# Altium project HVAC_Eth.PrjPcb (part 2 of 2)

## Sheet CV060_IO.SchDoc
size A4
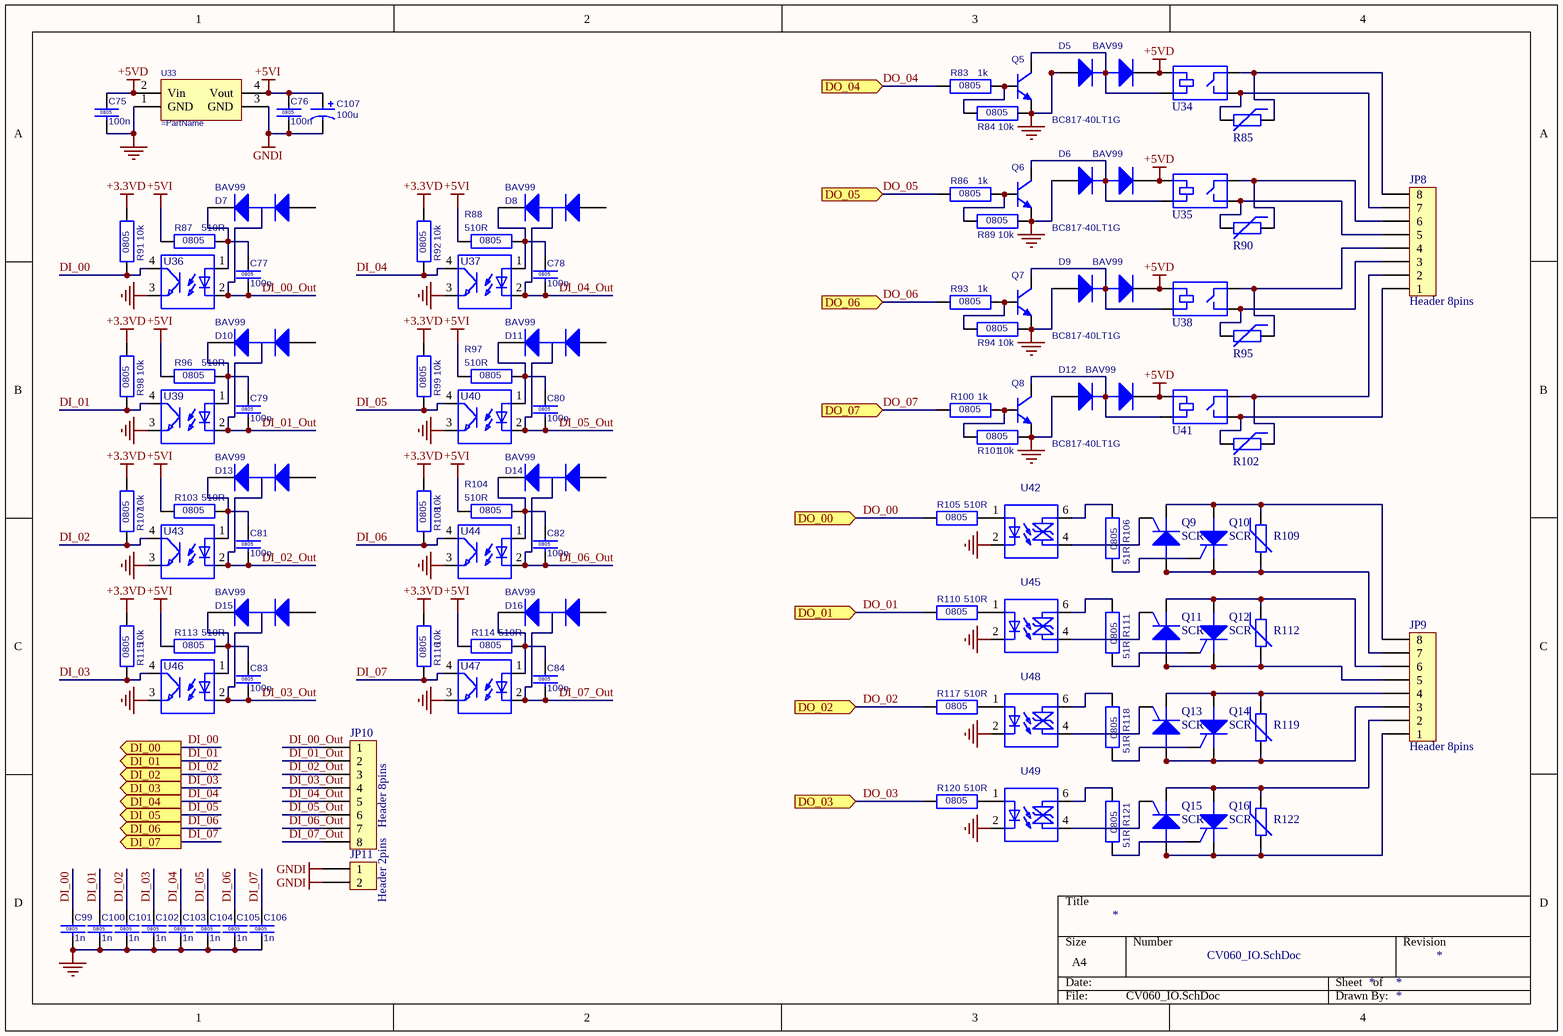
[diagram p2: CV060_IO.SchDoc]

### Parts
C75  Case: 0805  [RC0805]  (hidden comment: 100n)
C76  Case: 0805  [RC0805]  (hidden comment: 100n)
C77  Case: 0805  [RC0805]  (hidden comment: 100n)
C78  Case: 0805  [RC0805]  (hidden comment: 100n)
C79  Case: 0805  [RC0805]  (hidden comment: 100n)
C80  Case: 0805  [RC0805]  (hidden comment: 100n)
C81  Case: 0805  [RC0805]  (hidden comment: 100n)
C82  Case: 0805  [RC0805]  (hidden comment: 100n)
C83  Case: 0805  [RC0805]  (hidden comment: 100n)
C84  Case: 0805  [RC0805]  (hidden comment: 100n)
C99  Case: 0805  [RC0805]  (hidden comment: 1n)
C100  Case: 0805  [RC0805]  (hidden comment: 1n)
C101  Case: 0805  [RC0805]  (hidden comment: 1n)
C102  Case: 0805  [RC0805]  (hidden comment: 1n)
C103  Case: 0805  [RC0805]  (hidden comment: 1n)
C104  Case: 0805  [RC0805]  (hidden comment: 1n)
C105  Case: 0805  [RC0805]  (hidden comment: 1n)
C106  Case: 0805  [RC0805]  (hidden comment: 1n)
C107  100u  [CEH12.5D5P2.5]
D5  BAV99  [SOT23-3]
D6  BAV99  [SOT23-3]
D7  BAV99  [SOT23-3]
D8  BAV99  [SOT23-3]
D9  BAV99  [SOT23-3]
D10  BAV99  [SOT23-3]
D11  BAV99  [SOT23-3]
D12  BAV99  [SOT23-3]
D13  BAV99  [SOT23-3]
D14  BAV99  [SOT23-3]
D15  BAV99  [SOT23-3]
D16  BAV99  [SOT23-3]
JP8  Header 8pins  [PHOENIX_5.08_8PINS]
JP9  Header 8pins  [PHOENIX_5.08_8PINS]
JP10  Header 8pins  [PHOENIX_5.08_8PINS]
JP11  Header 2pins  [PHOENIX_5.08_2PINS]
Q5  Part number: BC817-40LT1G  [SOT23-3]  (hidden comment: NPN_transistor_SOT23-3)
Q6  Part number: BC817-40LT1G  [SOT23-3]  (hidden comment: NPN_transistor_SOT23-3)
Q7  Part number: BC817-40LT1G  [SOT23-3]  (hidden comment: NPN_transistor_SOT23-3)
Q8  Part number: BC817-40LT1G  [SOT23-3]  (hidden comment: NPN_transistor_SOT23-3)
Q9  SCR  [TO-220AB_V]
Q10  SCR  [TO-220AB_V]
Q11  SCR  [TO-220AB_V]
Q12  SCR  [TO-220AB_V]
Q13  SCR  [TO-220AB_V]
Q14  SCR  [TO-220AB_V]
Q15  SCR  [TO-220AB_V]
Q16  SCR  [TO-220AB_V]
R83  Case: 0805  [RC0805]  (hidden comment: 1k)
R84  Case: 0805  [RC0805]  (hidden comment: 10k)
R85  Varistor  [ROV07]  (value not drawn)
R86  Case: 0805  [RC0805]  (hidden comment: 1k)
R87  Case: 0805  [RC0805]  (hidden comment: 510R)
R88  Case: 0805  [RC0805]  (hidden comment: 510R)
R89  Case: 0805  [RC0805]  (hidden comment: 10k)
R90  Varistor  [ROV07]  (value not drawn)
R91  Case: 0805  [RC0805]  (hidden comment: 10k)
R92  Case: 0805  [RC0805]  (hidden comment: 10k)
R93  Case: 0805  [RC0805]  (hidden comment: 1k)
R94  Case: 0805  [RC0805]  (hidden comment: 10k)
R95  Varistor  [ROV07]  (value not drawn)
R96  Case: 0805  [RC0805]  (hidden comment: 510R)
R97  Case: 0805  [RC0805]  (hidden comment: 510R)
R98  Case: 0805  [RC0805]  (hidden comment: 10k)
R99  Case: 0805  [RC0805]  (hidden comment: 10k)
R100  Case: 0805  [RC0805]  (hidden comment: 1k)
R101  Case: 0805  [RC0805]  (hidden comment: 10k)
R102  Varistor  [ROV07]  (value not drawn)
R103  Case: 0805  [RC0805]  (hidden comment: 510R)
R104  Case: 0805  [RC0805]  (hidden comment: 510R)
R105  Case: 0805  [RC0805]  (hidden comment: 510R)
R106  Case: 0805  [RC0805]  (hidden comment: 51R)
R107  Case: 0805  [RC0805]  (hidden comment: 10k)
R108  Case: 0805  [RC0805]  (hidden comment: 10k)
R109  Varistor  [ROV07]  (value not drawn)
R110  Case: 0805  [RC0805]  (hidden comment: 510R)
R111  Case: 0805  [RC0805]  (hidden comment: 51R)
R112  Varistor  [ROV07]  (value not drawn)
R113  Case: 0805  [RC0805]  (hidden comment: 510R)
R114  Case: 0805  [RC0805]  (hidden comment: 510R)
R115  Case: 0805  [RC0805]  (hidden comment: 10k)
R116  Case: 0805  [RC0805]  (hidden comment: 10k)
R117  Case: 0805  [RC0805]  (hidden comment: 510R)
R118  Case: 0805  [RC0805]  (hidden comment: 51R)
R119  Varistor  [ROV07]  (value not drawn)
R120  Case: 0805  [RC0805]  (hidden comment: 510R)
R121  Case: 0805  [RC0805]  (hidden comment: 51R)
R122  Varistor  [ROV07]  (value not drawn)
U33  (no value)  [SIP4]
U34  NPA-AS5-DC5V  [NPA-AS5-DC5V]  (value not drawn)
U35  NPA-AS5-DC5V  [NPA-AS5-DC5V]  (value not drawn)
U36  PC817  [DIP4]  (value not drawn)
U37  PC817  [DIP4]  (value not drawn)
U38  NPA-AS5-DC5V  [NPA-AS5-DC5V]  (value not drawn)
U39  PC817  [DIP4]  (value not drawn)
U40  PC817  [DIP4]  (value not drawn)
U41  NPA-AS5-DC5V  [NPA-AS5-DC5V]  (value not drawn)
U42  MOC3063  [DIP6]  (value not drawn)
U43  PC817  [DIP4]  (value not drawn)
U44  PC817  [DIP4]  (value not drawn)
U45  MOC3063  [DIP6]  (value not drawn)
U46  PC817  [DIP4]  (value not drawn)
U47  PC817  [DIP4]  (value not drawn)
U48  MOC3063  [DIP6]  (value not drawn)
U49  MOC3063  [DIP6]  (value not drawn)

### Ports
DI_00 (out), DI_01 (out), DI_02 (out), DI_03 (out), DI_04 (out), DI_05 (out), DI_06 (out), DI_07 (out), DO_00 (in), DO_01 (in), DO_02 (in), DO_03 (in), DO_04 (in), DO_05 (in), DO_06 (in), DO_07 (in)

### Nets
+3.3VD: R91.2 R92.2 R98.2 R99.2 R107.2 R108.2 R115.2 R116.2
+5VD: C75.1 D5.2(K) D6.2(K) D9.2(K) D12.2(K) U33.2(Vin) U34.1 U35.1 U38.1 U41.1
+5VI: C76.1 C107.1 R87.1 R88.1 R96.1 R97.1 R103.1 R104.1 R113.1 R114.1 U33.4(Vout)
DGND: C75.2 C99.2 C100.2 C101.2 C102.2 C103.2 C104.2 C105.2 C106.2 D5.1(A) D6.1(A) D9.1(A) D12.1(A) Q5.2(E) Q6.2(E) Q7.2(E) Q8.2(E) R84.2 R89.2 R94.2 R101.2 U33.1(GND) U36.3 U37.3 U39.3 U40.3 U42.2 U43.3 U44.3 U45.2 U46.3 U47.3 U48.2 U49.2
GNDI: C76.2 C107.2 JP11.1 JP11.2 U33.3(GND)
DI_00: C99.1 R91.1 U36.4 ; port DI_00
DI_00_Out: C77.2 D7.3(C) JP10.1 U36.2
DI_01: C100.1 R98.1 U39.4 ; port DI_01
DI_01_Out: C79.2 D10.3(C) JP10.2 U39.2
DI_02: C101.1 R107.1 U43.4 ; port DI_02
DI_02_Out: C81.2 D13.3(C) JP10.3 U43.2
DI_03: C102.1 R115.1 U46.4 ; port DI_03
DI_03_Out: C83.2 D15.3(C) JP10.4 U46.2
DI_04: C103.1 R92.1 U37.4 ; port DI_04
DI_04_Out: C78.2 D8.3(C) JP10.5 U37.2
DI_05: C104.1 R99.1 U40.4 ; port DI_05
DI_05_Out: C80.2 D11.3(C) JP10.6 U40.2
DI_06: C105.1 R108.1 U44.4 ; port DI_06
DI_06_Out: C82.2 D14.3(C) JP10.7 U44.2
DI_07: C106.1 R116.1 U47.4 ; port DI_07
DI_07_Out: C84.2 D16.3(C) JP10.8 U47.2
DO_00: R105.1 ; port DO_00
DO_01: R110.1 ; port DO_01
DO_02: R117.1 ; port DO_02
DO_03: R120.1 ; port DO_03
DO_04: R83.1 ; port DO_04
DO_05: R86.1 ; port DO_05
DO_06: R93.1 ; port DO_06
DO_07: R100.1 ; port DO_07
NetC77_1: C77.1 D7.2(K) R87.2 U36.1
NetC78_1: C78.1 D8.2(K) R88.2 U37.1
NetC79_1: C79.1 D10.2(K) R96.2 U39.1
NetC80_1: C80.1 D11.2(K) R97.2 U40.1
NetC81_1: C81.1 D13.2(K) R103.2 U43.1
NetC82_1: C82.1 D14.2(K) R104.2 U44.1
NetC83_1: C83.1 D15.2(K) R113.2 U46.1
NetC84_1: C84.1 D16.2(K) R114.2 U47.1
NetD5_3: D5.3(C) Q5.3(C) U34.2
NetD6_3: D6.3(C) Q6.3(C) U35.2
NetD9_3: D9.3(C) Q7.3(C) U38.2
NetD12_3: D12.3(C) Q8.3(C) U41.2
NetJP8_1: JP8.1 R102.2 U41.4
NetJP8_2: JP8.2 R102.1 U41.3
NetJP8_3: JP8.3 R95.2 U38.4
NetJP8_4: JP8.4 R95.1 U38.3
NetJP8_5: JP8.5 R90.2 U35.4
NetJP8_6: JP8.6 R90.1 U35.3
NetJP8_7: JP8.7 R85.2 U34.4
NetJP8_8: JP8.8 R85.1 U34.3
NetJP9_1: JP9.1 Q15.2(A) Q15.4(TAB) Q16.1(K) R122.2
NetJP9_2: JP9.2 Q15.1(K) Q16.2(A) Q16.4(TAB) R122.1
NetJP9_3: JP9.3 Q13.2(A) Q13.4(TAB) Q14.1(K) R119.2
NetJP9_4: JP9.4 Q13.1(K) Q14.2(A) Q14.4(TAB) R119.1
NetJP9_5: JP9.5 Q11.2(A) Q11.4(TAB) Q12.1(K) R112.2
NetJP9_6: JP9.6 Q11.1(K) Q12.2(A) Q12.4(TAB) R112.1
NetJP9_7: JP9.7 Q9.2(A) Q9.4(TAB) Q10.1(K) R109.2
NetJP9_8: JP9.8 Q9.1(K) Q10.2(A) Q10.4(TAB) R109.1
NetQ5_1: Q5.1(B) R83.2 R84.1
NetQ6_1: Q6.1(B) R86.2 R89.1
NetQ7_1: Q7.1(B) R93.2 R94.1
NetQ8_1: Q8.1(B) R100.2 R101.1
NetQ9_3: Q9.3(G) U42.4
NetQ10_3: Q10.3(G) R106.2
NetQ11_3: Q11.3(G) U45.4
NetQ12_3: Q12.3(G) R111.2
NetQ13_3: Q13.3(G) U48.4
NetQ14_3: Q14.3(G) R118.2
NetQ15_3: Q15.3(G) U49.4
NetQ16_3: Q16.3(G) R121.2
NetR105_2: R105.2 U42.1
NetR106_1: R106.1 U42.6
NetR110_2: R110.2 U45.1
NetR111_1: R111.1 U45.6
NetR117_2: R117.2 U48.1
NetR118_1: R118.1 U48.6
NetR120_2: R120.2 U49.1
NetR121_1: R121.1 U49.6

Not connected (* = marked no-connect by the designer): D7 1(A); D8 1(A); D10 1(A); D11 1(A); D13 1(A); D14 1(A); D15 1(A); D16 1(A)

### Library data of the parts
C75-C84 = CC0805K-X5R-50V0-100N: Chip capacitor, 20p; Manufacturer: KEMET, YAGEO; Voltage: 50V; Tolerance: 10%; ROSH: Yes; Material: X5R; Package: 7" paper reel; Part number: CC0805K-X5R-50V0-100N; Suppliers: Avnet; Temperature: -55 - +125 C; Value: 100n; Supplier: Avnet-Abacus; Pb Free: Yes; Component Type: Standard; ComponentLink1Description: Manufacturer Link; ComponentLink2Description: Datasheet; ComponentLink2URL: http://www.yageo.com/pdf/UPY-GPHC_X5R_6.3V-to-50V_3.pdf; Published: 05.04.2010; Publisher: ppavlov
C99-C106 = CC0805K-X5R-50V0-1N00: Chip capacitor, 20p; Manufacturer: KEMET, YAGEO; Voltage: 50V; Tolerance: 10%; ROSH: Yes; Material: X5R; Package: 7" paper reel; Part number: CC0805K-X5R-50V0-1N00; Suppliers: Avnet; Temperature: -55 - +125 C; Value: 1n; Supplier: Avnet-Abacus; Pb Free: Yes; Component Type: Standard; ComponentLink1Description: Manufacturer Link; ComponentLink2Description: Datasheet; ComponentLink2URL: http://www.yageo.com/pdf/UPY-GPHC_X5R_6.3V-to-50V_3.pdf; Published: 05.04.2010; Publisher: ppavlov
C107 = CEH12.5D5P2.5M-16V-100U: Electrolytic capacitor; Manufacturer: Panasonic; Manufacturer Part Number: C H12.5D5P2.5M-16V-100U; Voltage: 16V; Tolerance: 20%; Pb Free: Yes; Case: 12.5x5x2.5; Value: 100u; Part Number: CEH12.5D5P2.5M-16V-100U; Temperature: -55 - +105 C; Supplier: Megasan; MOQ: 500; Component Type: Standard; ComponentLink1Description: Manufacturer Link; ComponentLink2Description: Datasheet; ComponentLink2URL: http://industrial.panasonic.com/www-data/pdf/ABA0000/ABA0000CE22.pdf; Published: 11.12.2009; Publisher: ppavlov
D5-D16 = BAV99: Dual small signal diode; Manufacturer: Fairchild; Forward current: 0.2A; Breakdown Voltage: 70V; Pb Free: Yes; Stock ID: D040; Temperature: -55 - +150 C; Supplier: EBV; Manufacturer Part Number: BAV99; Component Type: Standard; ComponentLink1Description: Manufacturer Link; Case: SOT23-3; ComponentLink2Description: Datasheet; ComponentLink2URL: http://www.fairchildsemi.com/ds/BA%2FBAV99.pdf; Published: 16.11.2009; Publisher: tkondratyuk; Part Number: BAV99; Current: 0.2A; Voltage: 70V
JP8-JP10 = 2EDGR-5.08-08P-14: 5.08mm angled 8pins receptabe; Manufacturer Part Number: 2EDGR-5.0-08P-14; Pins number: 8; Pb Free: Yes; Part Number: 2EDGR-5.08-08P-14; Temperature: -40 - +105 C; Supplier: Biakom; Component Type: Standard; ComponentLink1Description: Manufacturer Link; Case: PHOENIX_5.08_8PINS; ComponentLink2Description: Datasheet; Published: 17.08.2010; Publisher: ppavlov
JP11 = 2EDGR-5.08-02P-14: 5mm angled 2pins receptabe; Manufacturer Part Number: 2EDGR-5.0-02P-14; Pins number: 2; Pb Free: Yes; Part Number: 2EDGR-5.08-02P-14; Temperature: -40 - +105 C; Component Type: Standard; ComponentLink1Description: Manufacturer Link; Case: PHOENIX_5.08_2PINS; ComponentLink2Description: Datasheet; Published: 04.01.2010; Publisher: ppavlov
Q5-Q8 = BC817-40LT1G: General Purpose  NPN Transistor; Manufacturer: ONS, NXP; Manufacturer Part Number: BC817?40LT1G; Current: 0.5A; Voltage CEO: 40V; Pb Free: Yes; Temperature: -55 - +150 C; Supplier: EBV; MOQ: 3000; Package: Tape and Reel; Component Type: Standard; ComponentLink1Description: Manufacturer Link; Case: SOT23-3; ComponentLink2Description: Datasheet; ComponentLink2URL: http://www.onsemi.com/pub/Collateral/BC817-16LT1-D.PDF; Published: 16.02.2010; Publisher: ppavlov
Q9-Q16 = BT151-800_V: Thyristor; Current: 8A; Voltage CEO: 800; Pb Free: Yes; Part Number: BT151-800_V; Temperature: -55 - +150 C; Manufacturer Part Number: BT151-800; Component Type: Standard; ComponentLink1Description: Manufacturer Link; Case: TO-220AB_H; ComponentLink2Description: Datasheet; Published: 08.04.2010; Publisher: ppavlov
R83 R86 R93 R100 = RC0805F-1K00: Chip resistor; Manufacturer: PHILIPS, SAMSUNG; Voltage: 200V; Power: 1/10W; Tolerance: 1%; Pb Free: Yes; Value: 1k; Part Number: RC0805F-1K00; Temperature: -55 - +155 C; Supplier: Megasan; Component Type: Standard; ComponentLink1Description: Manufacturer Link; ComponentLink2Description: Datasheet; ComponentLink2URL: http://www.yageo.com/pdf/PYu-RC1206_51_RoHS_L_4.pdf; Published: 11.12.2009; Publisher: ppavlov
R84 R89 R91 R92 R94 R98 R99 R101 R107 R108 R115 R116 = RC0805F-10K0: Chip resistor; Manufacturer: PHILIPS, SAMSUNG; Voltage: 200V; Power: 1/10W; Tolerance: 1%; Pb Free: Yes; Value: 10k; Part Number: RC0805F-10K0; Temperature: -55 - +155 C; Supplier: Megasan; Component Type: Standard; ComponentLink1Description: Manufacturer Link; ComponentLink2Description: Datasheet; ComponentLink2URL: http://www.yageo.com/pdf/PYu-RC1206_51_RoHS_L_4.pdf; Published: 11.12.2009; Publisher: ppavlov
R85 R90 R95 R102 R109 R112 R119 R122 = ROV07-391K: Manufacturer: Raychem; Manufacturer Part Number: ROV07-361K; Current: 10A; Voltage: 250AC; Pb Free: Yes; Part Number: ROV07-391K; Temperature: -40 - +125 C; Component Type: Standard; ComponentLink1Description: Manufacturer Link; Case: ROV07; ComponentLink2Description: Datasheet; Published: 17.08.2010; Publisher: ppavlov
R87 R88 R96 R97 R103-R105 R110 R113 R114 R117 R120 = RC0805F-510R: Chip resistor; Manufacturer: PHILIPS, SAMSUNG; Voltage: 200V; Power: 1/10W; Tolerance: 1%; Pb Free: Yes; Value: 510R; Part Number: RC0805F-510R; Temperature: -55 - +155 C; Supplier: Megasan; Component Type: Standard; ComponentLink1Description: Manufacturer Link; ComponentLink2Description: Datasheet; ComponentLink2URL: http://www.yageo.com/pdf/PYu-RC1206_51_RoHS_L_4.pdf; Published: 11.12.2009; Publisher: ppavlov
R106 R111 R118 R121 = RC0805F-51R0: Chip resistor; Manufacturer: PHILIPS, SAMSUNG; Voltage: 200V; Power: 1/10W; Tolerance: 1%; Pb Free: Yes; Value: 51R; Part Number: RC0805F-51R0; Temperature: -55 - +155 C; Supplier: Megasan; Component Type: Standard; ComponentLink1Description: Manufacturer Link; ComponentLink2Description: Datasheet; ComponentLink2URL: http://www.yageo.com/pdf/PYu-RC1206_51_RoHS_L_4.pdf; Published: 11.12.2009; Publisher: ppavlov
U33 = 1-05-05S: 1W Insulated DCDC converter; Manufacturer: TI; Manufacturer Part Number: E101E; Pb Free: Yes; Part Number: 1-05-05S; Temperature: -40 - +85 C; Component Type: Standard; ComponentLink1Description: Manufacturer Link; Case: SIP4; ComponentLink2Description: Datasheet; Published: 07.01.2010; Publisher: ppavlov
U34 U35 U38 U41 = NPA-AS5-DC5V: Standard; Part Number: NPA-AS5-DC5V; Manufacturer Part Number: NPA-AS5-DC5V; Package: NPA-AS5-DC5V; Component Type: Relay; Case: NPA-AS5-DC5V; Published: 05.04.2010; Publisher: ppavlov; ComponentLink2Description: Datasheet
U36 U37 U39 U40 U43 U44 U46 U47 = PC817C: General purpose optocouple; Manufacturer: Sharp; Part Number: PC817C; Manufacturer Part Number: PC817C; Component Type: Standard; ComponentLink1Description: Manufacturer Link; Case: DIP4; ComponentLink2Description: Datasheet; Published: 06.04.2010; Publisher: ppavlov
U42 U45 U48 U49 = MOC3063: Zero-Cross Phototriac Driver Optocoupler; Manufacturer: Fairchild; Part Number: MOC3063; Manufacturer Part Number: MOC3063; Component Type: Standard; ComponentLink1Description: Manufacturer Link; Case: DIP6; ComponentLink2Description: Datasheet; ComponentLink2URL: http://www.fairchildsemi.com/ds/MO%2FMOC3061-M.pdf; Published: 06.04.2010; Publisher: ppavlov

## Sheet CV060_AO.SchDoc
size A4
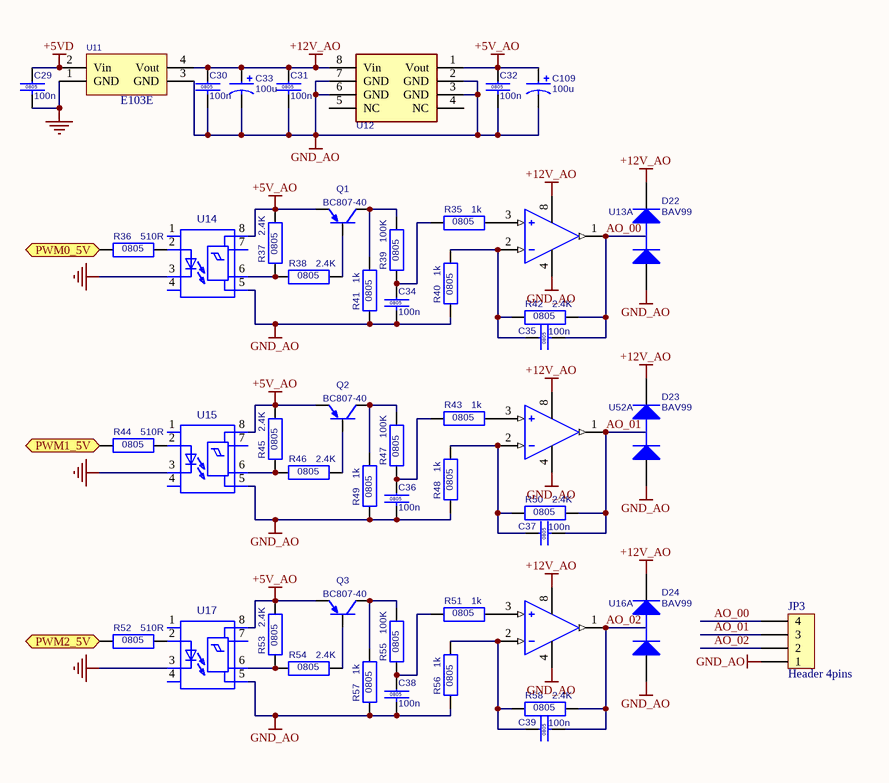
[diagram p3: CV060_AO.SchDoc]

### Parts
C29  Case: 0805  [RC0805]  (hidden comment: 100n)
C30  Case: 0805  [RC0805]  (hidden comment: 100n)
C31  Case: 0805  [RC0805]  (hidden comment: 100n)
C32  Case: 0805  [RC0805]  (hidden comment: 100n)
C33  100u  [CEH12.5D5P2.5]
C34  Case: 0805  [RC0805]  (hidden comment: 100n)
C35  Case: 0805  [RC0805]  (hidden comment: 100n)
C36  Case: 0805  [RC0805]  (hidden comment: 100n)
C37  Case: 0805  [RC0805]  (hidden comment: 100n)
C38  Case: 0805  [RC0805]  (hidden comment: 100n)
C39  Case: 0805  [RC0805]  (hidden comment: 100n)
C109  100u  [CEH12.5D5P2.5]
D22  BAV99  [SOT23-3]
D23  BAV99  [SOT23-3]
D24  BAV99  [SOT23-3]
JP3  Header 4pins  [PHOENIX_5.08_4PINS]
Q1  Part number: BC807-40  [SOT23-3]  (hidden comment: PNP_transistor_SOT23-3)
Q2  Part number: BC807-40  [SOT23-3]  (hidden comment: PNP_transistor_SOT23-3)
Q3  Part number: BC807-40  [SOT23-3]  (hidden comment: PNP_transistor_SOT23-3)
R35  Case: 0805  [RC0805]  (hidden comment: 1k)
R36  Case: 0805  [RC0805]  (hidden comment: 510R)
R37  Case: 0805  [RC0805]  (hidden comment: 2.4K)
R38  Case: 0805  [RC0805]  (hidden comment: 2.4K)
R39  Case: 0805  [RC0805]  (hidden comment: 100K)
R40  Case: 0805  [RC0805]  (hidden comment: 1k)
R41  Case: 0805  [RC0805]  (hidden comment: 1k)
R42  Case: 0805  [RC0805]  (hidden comment: 2.4K)
R43  Case: 0805  [RC0805]  (hidden comment: 1k)
R44  Case: 0805  [RC0805]  (hidden comment: 510R)
R45  Case: 0805  [RC0805]  (hidden comment: 2.4K)
R46  Case: 0805  [RC0805]  (hidden comment: 2.4K)
R47  Case: 0805  [RC0805]  (hidden comment: 100K)
R48  Case: 0805  [RC0805]  (hidden comment: 1k)
R49  Case: 0805  [RC0805]  (hidden comment: 1k)
R50  Case: 0805  [RC0805]  (hidden comment: 2.4K)
R51  Case: 0805  [RC0805]  (hidden comment: 1k)
R52  Case: 0805  [RC0805]  (hidden comment: 510R)
R53  Case: 0805  [RC0805]  (hidden comment: 2.4K)
R54  Case: 0805  [RC0805]  (hidden comment: 2.4K)
R55  Case: 0805  [RC0805]  (hidden comment: 100K)
R56  Case: 0805  [RC0805]  (hidden comment: 1k)
R57  Case: 0805  [RC0805]  (hidden comment: 1k)
R58  Case: 0805  [RC0805]  (hidden comment: 2.4K)
U11  Manufacturer Part Number: E103E  [SIP4]
U12  L78L05CD  [SO-8]  (value not drawn)
U13  LM2904D  [SO-8]  (value not drawn)  (part A of 2)
U14  6N137  [DIP8]  (value not drawn)
U15  6N137  [DIP8]  (value not drawn)
U16  LM2904D  [SO-8]  (value not drawn)  (part A of 2)
U17  6N137  [DIP8]  (value not drawn)
U52  LM2904D  [SO-8]  (value not drawn)  (part A of 2)

### Ports
PWM0_5V (in), PWM1_5V (in), PWM2_5V (in)

### Nets
+5V_AO: C32.1 C109.1 Q1.2(E) Q2.2(E) Q3.2(E) R37.2 R45.2 R53.2 U12.1(Vout) U14.8 U15.8 U17.8
+5VD: C29.1 U11.2(Vin)
+12V_AO: C30.1 C31.1 C33.1 D22.2(K) D23.2(K) D24.2(K) U11.4(Vout) U12.8(Vin) U13.8(Vcc+) U16.8(Vcc+) U52.8(Vcc+)
DGND: C29.2 U11.1(GND) U14.3 U15.3 U17.3
GND_AO: C30.2 C31.2 C32.2 C33.2 C34.2 C36.2 C38.2 C109.2 D22.1(A) D23.1(A) D24.1(A) JP3.1 R40.1 R41.1 R48.1 R49.1 R56.1 R57.1 U11.3(GND) U12.2(GND) U12.3(GND) U12.6(GND) U12.7(GND) U13.4(Vcc-) U14.5 U15.5 U16.4(Vcc-) U17.5 U52.4(Vcc-)
AO_00: C35.2 D22.3(C) JP3.4 R42.2 U13.1(OUT1)
AO_01: C37.2 D23.3(C) JP3.3 R50.2 U52.1(OUT1)
AO_02: C39.2 D24.3(C) JP3.2 R58.2 U16.1(OUT1)
NetC34_1: C34.1 R35.1 R39.1
NetC35_1: C35.1 R40.2 R42.1 U13.2(IN1-)
NetC36_1: C36.1 R43.1 R47.1
NetC37_1: C37.1 R48.2 R50.1 U52.2(IN1-)
NetC38_1: C38.1 R51.1 R55.1
NetC39_1: C39.1 R56.2 R58.1 U16.2(IN1-)
NetQ1_1: Q1.1(B) R38.2
NetQ1_3: Q1.3(C) R39.2 R41.2
NetQ2_1: Q2.1(B) R46.2
NetQ2_3: Q2.3(C) R47.2 R49.2
NetQ3_1: Q3.1(B) R54.2
NetQ3_3: Q3.3(C) R55.2 R57.2
NetR35_2: R35.2 U13.3(IN1+)
NetR36_1: R36.1 ; port PWM0_5V
NetR36_2: R36.2 U14.2
NetR37_1: R37.1 R38.1 U14.6
NetR43_2: R43.2 U52.3(IN1+)
NetR44_1: R44.1 ; port PWM1_5V
NetR44_2: R44.2 U15.2
NetR45_1: R45.1 R46.1 U15.6
NetR51_2: R51.2 U16.3(IN1+)
NetR52_1: R52.1 ; port PWM2_5V
NetR52_2: R52.2 U17.2
NetR53_1: R53.1 R54.1 U17.6

Not connected (* = marked no-connect by the designer): U12 4(NC) 5(NC); U14 1 4 7; U15 1 4 7; U17 1 4 7

### Library data of the parts
C29-C32 C34-C39 = CC0805K-X5R-50V0-100N: as C75 on sheet CV060_IO; Package: 7" paper reel; Part number: CC0805K-X5R-50V0-100N; Suppliers: Avnet; Temperature: -55 - +125 C; Value: 100n; Supplier: Avnet-Abacus; Pb Free: Yes; Component Type: Standard; ComponentLink1Description: Manufacturer Link; ComponentLink2Description: Datasheet; ComponentLink2URL: http://www.yageo.com/pdf/UPY-GPHC_X5R_6.3V-to-50V_3.pdf; Published: 05.04.2010; Publisher: ppavlov
C33 C109 = CEH12.5D5P2.5M-16V-100U: as C107 on sheet CV060_IO; Case: 12.5x5x2.5; Value: 100u; Part Number: CEH12.5D5P2.5M-16V-100U; Temperature: -55 - +105 C; Supplier: Megasan; MOQ: 500; Component Type: Standard; ComponentLink1Description: Manufacturer Link; ComponentLink2Description: Datasheet; ComponentLink2URL: http://industrial.panasonic.com/www-data/pdf/ABA0000/ABA0000CE22.pdf; Published: 11.12.2009; Publisher: ppavlov
D22-D24 = BAV99: as D5 on sheet CV060_IO; Stock ID: D040; Temperature: -55 - +150 C; Supplier: EBV; Manufacturer Part Number: BAV99; Component Type: Standard; ComponentLink1Description: Manufacturer Link; Case: SOT23-3; ComponentLink2Description: Datasheet; ComponentLink2URL: http://www.fairchildsemi.com/ds/BA%2FBAV99.pdf; Published: 16.11.2009; Publisher: tkondratyuk; Part Number: BAV99; Current: 0.2A; Voltage: 70V
JP3 = 2EDGR-5.08-04P-14: 5.08mm angled 4pins receptabe; Manufacturer Part Number: 2EDGR-5.0-04P-14; Pins number: 4; Pb Free: Yes; Part Number: 2EDGR-5.08-04P-14; Temperature: -40 - +105 C; Supplier: Biakom; Component Type: Standard; ComponentLink1Description: Manufacturer Link; Case: PHOENIX_5.08_4PINS; ComponentLink2Description: Datasheet; Published: 17.08.2010; Publisher: ppavlov
Q1-Q3 = BC807-40: General Purpose  PNP Transistor; Manufacturer: ONS, NXP; Manufacturer Part Number: BC807?40LT1G; Analogs: MMBT2907A; Current: 0.5A; Voltage CEO: -45V; Pb Free: Yes; Stock ID: Q010; Temperature: -55 - +150 C; Supplier: EBV; MOQ: 3000; Package: Tape and Reel; Component Type: Standard; ComponentLink1Description: Manufacturer Link; Case: SOT23-3; ComponentLink2Description: Datasheet; ComponentLink2URL: http://www.onsemi.com/pub/Collateral/BC807-16LT1-D.PDF; Published: 16.11.2009; Publisher: tkondratyuk
R35 R40 R41 R43 R48 R49 R51 R56 R57 = RC0805F-1K00: as R83 on sheet CV060_IO; Value: 1k; Part Number: RC0805F-1K00; Temperature: -55 - +155 C; Supplier: Megasan; Component Type: Standard; ComponentLink1Description: Manufacturer Link; ComponentLink2Description: Datasheet; ComponentLink2URL: http://www.yageo.com/pdf/PYu-RC1206_51_RoHS_L_4.pdf; Published: 11.12.2009; Publisher: ppavlov
R36 R44 R52 = RC0805F-510R: as R87 on sheet CV060_IO; Value: 510R; Part Number: RC0805F-510R; Temperature: -55 - +155 C; Supplier: Megasan; Component Type: Standard; ComponentLink1Description: Manufacturer Link; ComponentLink2Description: Datasheet; ComponentLink2URL: http://www.yageo.com/pdf/PYu-RC1206_51_RoHS_L_4.pdf; Published: 11.12.2009; Publisher: ppavlov
R37 R38 R42 R45 R46 R50 R53 R54 R58 = RC0805F-2K40: Chip resistor; Manufacturer: PHILIPS, SAMSUNG; Voltage: 200V; Power: 1/10W; Tolerance: 1%; Pb Free: Yes; Value: 2.4K; Part Number: RC0805F-2K40; Temperature: -55 - +155 C; Supplier: Megasan; Component Type: Standard; ComponentLink1Description: Manufacturer Link; ComponentLink2Description: Datasheet; ComponentLink2URL: http://www.yageo.com/pdf/PYu-RC1206_51_RoHS_L_4.pdf; Published: 11.12.2009; Publisher: ppavlov
R39 R47 R55 = RC0805F-100K: Chip resistor; Manufacturer: PHILIPS, SAMSUNG; Voltage: 200V; Power: 1/10W; Tolerance: 1%; Pb Free: Yes; Value: 100K; Part Number: RC0805F-100K; Temperature: -55 - +155 C; Supplier: Megasan; Component Type: Standard; ComponentLink1Description: Manufacturer Link; ComponentLink2Description: Datasheet; ComponentLink2URL: http://www.yageo.com/pdf/PYu-RC1206_51_RoHS_L_4.pdf; Published: 11.12.2009; Publisher: ppavlov
U11 = 1-05-12S: 1W Insulated DCDC converter 5 to 12V; Manufacturer: TI; Pb Free: Yes; Part Number: 1-05-12S; Temperature: -40 - +85 C; Component Type: Standard; ComponentLink1Description: Manufacturer Link; Case: SIP4; ComponentLink2Description: Datasheet; Published: 07.01.2010; Publisher: ppavlov
U12 = L78L05CD: Regulator 100ma 5V; Manufacturer: ST; Pb Free: Yes; Part Number: L78L05CD; Temperature: -40 - +150 C; Manufacturer Part Number: L78L05CD; Component Type: Standard; ComponentLink1Description: Manufacturer Link; Case: SO-8; ComponentLink2Description: Datasheet; Published: 07.01.2010; Publisher: ppavlov
U13 U16 U52 = LM2904D: Dual opamps; Manufacturer: TI; Pb Free: Yes; Part Number: LM2904D; Temperature: -40 - +125 C; Supplier: EBV; Manufacturer Part Number: LM2904D; Component Type: Standard; ComponentLink1Description: Manufacturer Link; Case: SO-8; ComponentLink2Description: Datasheet; ComponentLink2URL: http://www.ti.com/lit/gpn/lm2904; Published: 13.11.2009; Publisher: tkondratyuk
U14 U15 U17 = 6N137: High CMR, High Speed TTL / Compatible Optocouplers; Value: *; Part Number: 6N137; Manufacturer Part Number: 6N137; Component Type: Standard; ComponentLink1Description: Manufacturer Link; Case: DIP8; ComponentLink2Description: Datasheet; Published: 06.04.2010; Publisher: ppavlov

## Sheet CV060_AI.SchDoc
size A4
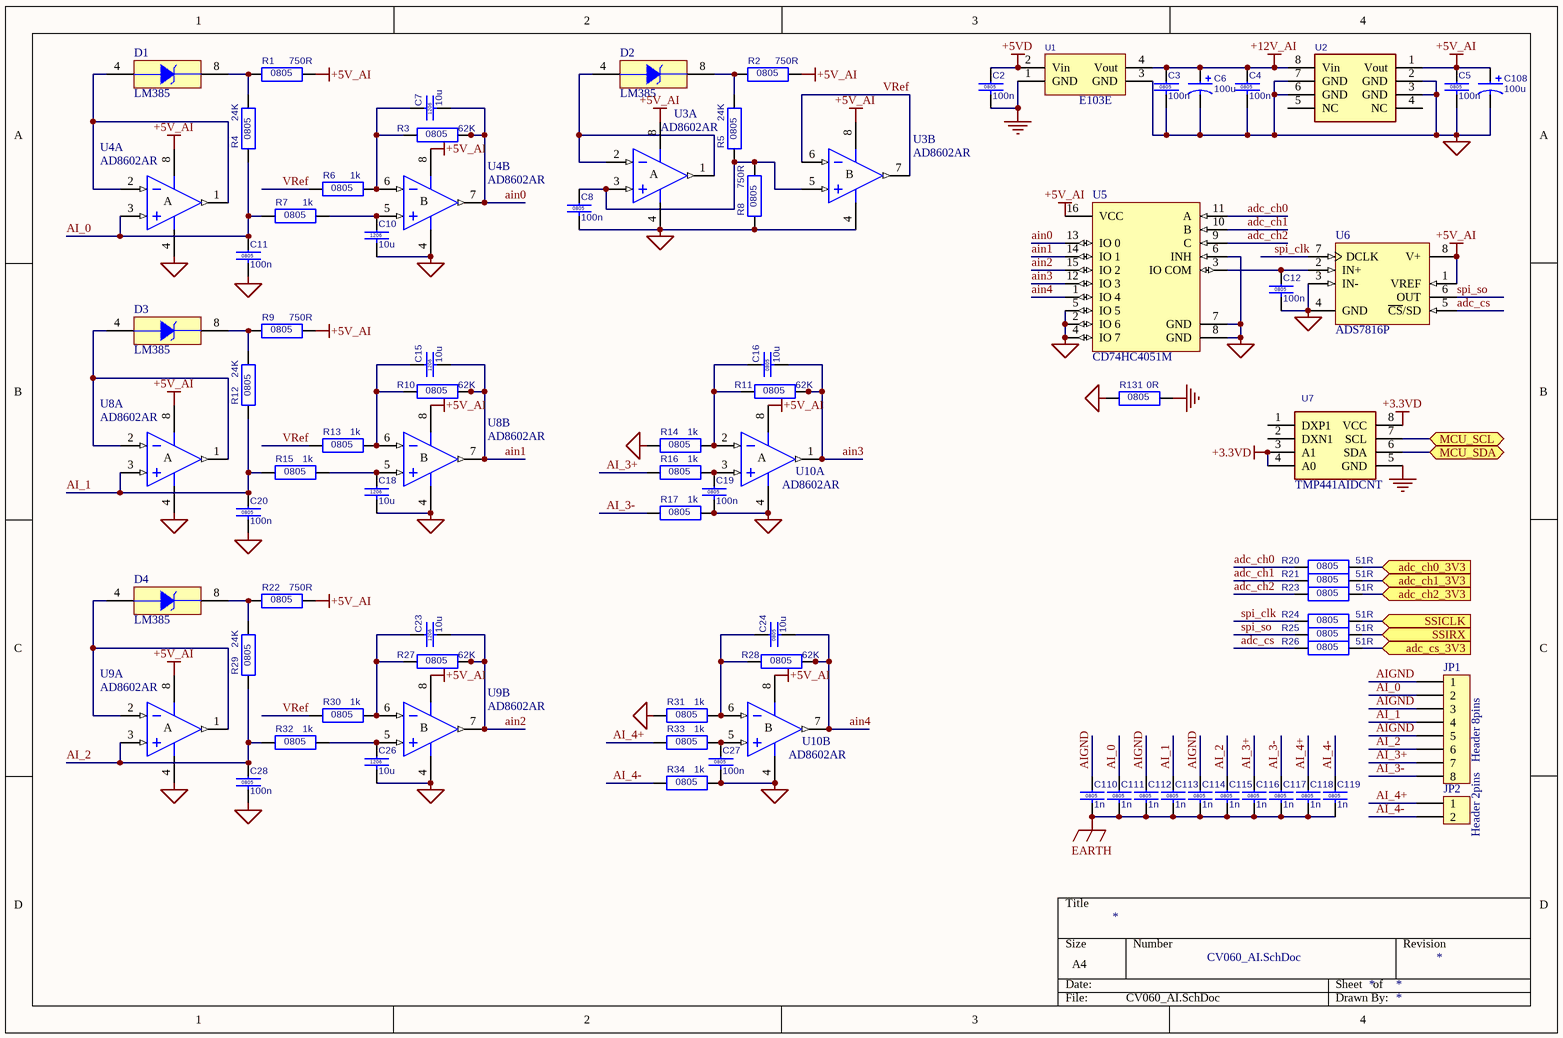
[diagram p4: CV060_AI.SchDoc]

### Parts
C2  Case: 0805  [RC0805]  (hidden comment: 100n)
C3  Case: 0805  [RC0805]  (hidden comment: 100n)
C4  Case: 0805  [RC0805]  (hidden comment: 100n)
C5  Case: 0805  [RC0805]  (hidden comment: 100n)
C6  100u  [CEH12.5D5P2.5]
C7  Case: 1206  [RC1206]  (hidden comment: 10u)
C8  Case: 0805  [RC0805]  (hidden comment: 100n)
C10  Case: 1206  [RC1206]  (hidden comment: 10u)
C11  Case: 0805  [RC0805]  (hidden comment: 100n)
C12  Case: 0805  [RC0805]  (hidden comment: 100n)
C15  Case: 1206  [RC1206]  (hidden comment: 10u)
C16  Case: 0805  [RC0805]  (hidden comment: 10u)
C18  Case: 1206  [RC1206]  (hidden comment: 10u)
C19  Case: 0805  [RC0805]  (hidden comment: 100n)
C20  Case: 0805  [RC0805]  (hidden comment: 100n)
C23  Case: 1206  [RC1206]  (hidden comment: 10u)
C24  Case: 0805  [RC0805]  (hidden comment: 10u)
C26  Case: 1206  [RC1206]  (hidden comment: 10u)
C27  Case: 0805  [RC0805]  (hidden comment: 100n)
C28  Case: 0805  [RC0805]  (hidden comment: 100n)
C108  100u  [CEH12.5D5P2.5]
C110  Case: 0805  [RC0805]  (hidden comment: 1n)
C111  Case: 0805  [RC0805]  (hidden comment: 1n)
C112  Case: 0805  [RC0805]  (hidden comment: 1n)
C113  Case: 0805  [RC0805]  (hidden comment: 1n)
C114  Case: 0805  [RC0805]  (hidden comment: 1n)
C115  Case: 0805  [RC0805]  (hidden comment: 1n)
C116  Case: 0805  [RC0805]  (hidden comment: 1n)
C117  Case: 0805  [RC0805]  (hidden comment: 1n)
C118  Case: 0805  [RC0805]  (hidden comment: 1n)
C119  Case: 0805  [RC0805]  (hidden comment: 1n)
D1  LM385  [SO-8]
D2  LM385  [SO-8]
D3  LM385  [SO-8]
D4  LM385  [SO-8]
JP1  Header 8pins  [PHOENIX_5.08_8PINS]
JP2  Header 2pins  [PHOENIX_5.08_2PINS]
R1  Case: 0805  [RC0805]  (hidden comment: 750R)
R2  Case: 0805  [RC0805]  (hidden comment: 750R)
R3  Case: 0805  [RC0805]  (hidden comment: 62K)
R4  Case: 0805  [RC0805]  (hidden comment: 24K)
R5  Case: 0805  [RC0805]  (hidden comment: 24K)
R6  Case: 0805  [RC0805]  (hidden comment: 1k)
R7  Case: 0805  [RC0805]  (hidden comment: 1k)
R8  Case: 0805  [RC0805]  (hidden comment: 750R)
R9  Case: 0805  [RC0805]  (hidden comment: 750R)
R10  Case: 0805  [RC0805]  (hidden comment: 62K)
R11  Case: 0805  [RC0805]  (hidden comment: 62K)
R12  Case: 0805  [RC0805]  (hidden comment: 24K)
R13  Case: 0805  [RC0805]  (hidden comment: 1k)
R14  Case: 0805  [RC0805]  (hidden comment: 1k)
R15  Case: 0805  [RC0805]  (hidden comment: 1k)
R16  Case: 0805  [RC0805]  (hidden comment: 1k)
R17  Case: 0805  [RC0805]  (hidden comment: 1k)
R20  Case: 0805  [RC0805]  (hidden comment: 51R)
R21  Case: 0805  [RC0805]  (hidden comment: 51R)
R22  Case: 0805  [RC0805]  (hidden comment: 750R)
R23  Case: 0805  [RC0805]  (hidden comment: 51R)
R24  Case: 0805  [RC0805]  (hidden comment: 51R)
R25  Case: 0805  [RC0805]  (hidden comment: 51R)
R26  Case: 0805  [RC0805]  (hidden comment: 51R)
R27  Case: 0805  [RC0805]  (hidden comment: 62K)
R28  Case: 0805  [RC0805]  (hidden comment: 62K)
R29  Case: 0805  [RC0805]  (hidden comment: 24K)
R30  Case: 0805  [RC0805]  (hidden comment: 1k)
R31  Case: 0805  [RC0805]  (hidden comment: 1k)
R32  Case: 0805  [RC0805]  (hidden comment: 1k)
R33  Case: 0805  [RC0805]  (hidden comment: 1k)
R34  Case: 0805  [RC0805]  (hidden comment: 1k)
R131  Case: 0805  [RC0805]  (hidden comment: 0R)
U1  Manufacturer Part Number: E103E  [SIP4]
U2  L78L05CD  [SO-8]  (value not drawn)
U3  AD8602AR  [SO-8]  (parts A,B of 2)
U4  AD8602AR  [SO-8]  (parts A,B of 2)
U5  CD74HC4051M  [SO-16]
U6  ADS7816P  [DIP-8]
U7  TMP441AIDCNT  [SOT23-8]
U8  AD8602AR  [SO-8]  (parts A,B of 2)
U9  AD8602AR  [SO-8]  (parts A,B of 2)
U10  AD8602AR  [SO-8]  (parts A,B of 2)

### Ports
adc_ch0_3V3 (in), adc_ch1_3V3 (in), adc_ch2_3V3 (in), adc_cs_3V3 (in), MCU_SCL, MCU_SDA, SSICLK (in), SSIRX (in)

### Nets
+3.3VD: U7.3(A1) U7.4(A0) U7.8(VCC)
+5V_AI: C5.1 C108.1 R1.2 R2.2 R9.2 R22.2 U2.1(Vout) U3.8(V+) U4.8(V+) U5.16(VCC) U6.1(VREF) U6.8(V+) U8.8(V+) U9.8(V+) U10.8(V+)
+5VD: C2.1 U1.2(Vin)
+12V_AI: C3.1 C4.1 C6.1 U1.4(Vout) U2.8(Vin)
AIGND: C3.2 C4.2 C5.2 C6.2 C8.2 C10.2 C11.2 C12.2 C18.2 C19.2 C20.2 C26.2 C27.2 C28.2 C108.2 C110.1 C112.1 C114.1 JP1.1 JP1.3 JP1.5 R8.1 R14.1 R17.2 R31.1 R34.2 R131.1 U1.3(GND) U2.2(GND) U2.3(GND) U2.6(GND) U2.7(GND) U3.4(V-) U4.4(V-) U5.2(IO_6) U5.4(IO_7) U5.5(IO_5) U5.6(INH) U5.7(GND) U5.8(GND) U6.3(IN-) U6.4(GND) U8.4(V-) U9.4(V-) U10.4(V-)
DGND: C2.2 R131.2 U1.1(GND) U7.5(GND)
EARTH: C110.2 C111.2 C112.2 C113.2 C114.2 C115.2 C116.2 C117.2 C118.2 C119.2
adc_ch0: R20.1 U5.11(A)
adc_ch1: R21.1 U5.10(B)
adc_ch2: R23.1 U5.9(C)
adc_cs: R26.1 U6.5(~{CS}/SD)
AI_0: C11.1 C111.1 JP1.2 R4.1 R7.1 U4.3(IN+)
AI_1: C20.1 C113.1 JP1.4 R12.1 R15.1 U8.3(IN+)
AI_2: C28.1 C115.1 JP1.6 R29.1 R32.1 U9.3(IN+)
AI_3+: C116.1 JP1.7 R16.1
AI_3-: C117.1 JP1.8 R17.1
AI_4+: C118.1 JP2.1 R33.1
AI_4-: C119.1 JP2.2 R34.1
ain0: C7.2 R3.2 U4.7(OUT) U5.13(IO_0)
ain1: C15.2 R10.2 U5.14(IO_1) U8.7(OUT)
ain2: C23.2 R27.2 U5.15(IO_2) U9.7(OUT)
ain3: C16.2 R11.2 U5.12(IO_3) U10.1(OUT)
ain4: C24.2 R28.2 U5.1(IO_4) U10.7(OUT)
spi_clk: R24.1 U6.7(DCLK)
spi_so: R25.1 U6.6(OUT)
SSICLK: R24.2 ; port SSICLK
SSIRX: R25.2 ; port SSIRX
VRef: R6.1 R13.1 R30.1 U3.6(IN-) U3.7(OUT)
NetC7_1: C7.1 R3.1 R6.2 U4.6(IN-)
NetC8_1: C8.1 R5.1 R8.2 U3.3(IN+) U3.5(IN+)
NetC10_1: C10.1 R7.2 U4.5(IN+)
NetC12_1: C12.1 U5.3(IO_COM) U6.2(IN+)
NetC15_1: C15.1 R10.1 R13.2 U8.6(IN-)
NetC16_1: C16.1 R11.1 R14.2 U10.2(IN-)
NetC18_1: C18.1 R15.2 U8.5(IN+)
NetC19_1: C19.1 R16.2 U10.3(IN+)
NetC23_1: C23.1 R27.1 R30.2 U9.6(IN-)
NetC24_1: C24.1 R28.1 R31.2 U10.6(IN-)
NetC26_1: C26.1 R32.2 U9.5(IN+)
NetC27_1: C27.1 R33.2 U10.5(IN+)
NetC121_1: U7.6(SDA) ; port MCU_SDA
NetC122_1: U7.7(SCL) ; port MCU_SCL
NetD1_4: D1.4(A) U4.1(OUT) U4.2(IN-)
NetD1_8: D1.8(K) R1.1 R4.2
NetD2_4: D2.4(A) U3.1(OUT) U3.2(IN-)
NetD2_8: D2.8(K) R2.1 R5.2
NetD3_4: D3.4(A) U8.1(OUT) U8.2(IN-)
NetD3_8: D3.8(K) R9.1 R12.2
NetD4_4: D4.4(A) U9.1(OUT) U9.2(IN-)
NetD4_8: D4.8(K) R22.1 R29.2
NetR20_2: R20.2 ; port adc_ch0_3V3
NetR21_2: R21.2 ; port adc_ch1_3V3
NetR23_2: R23.2 ; port adc_ch2_3V3
NetR26_2: R26.2 ; port adc_cs_3V3

Not connected (* = marked no-connect by the designer): U2 4(NC) 5(NC); U7 1(DXP1) 2(DXN1)

### Notes on the sheet
- (in symbol AD8602AR, part A) A
- (in symbol AD8602AR, part B) B

### Library data of the parts
C2-C5 C8 C11 C12 C19 C20 C27 C28 = CC0805K-X5R-50V0-100N: as C75 on sheet CV060_IO; Package: 7" paper reel; Part number: CC0805K-X5R-50V0-100N; Suppliers: Avnet; Temperature: -55 - +125 C; Value: 100n; Supplier: Avnet-Abacus; Pb Free: Yes; Component Type: Standard; ComponentLink1Description: Manufacturer Link; ComponentLink2Description: Datasheet; ComponentLink2URL: http://www.yageo.com/pdf/UPY-GPHC_X5R_6.3V-to-50V_3.pdf; Published: 05.04.2010; Publisher: ppavlov
C6 C108 = CEH12.5D5P2.5M-16V-100U: as C107 on sheet CV060_IO; Case: 12.5x5x2.5; Value: 100u; Part Number: CEH12.5D5P2.5M-16V-100U; Temperature: -55 - +105 C; Supplier: Megasan; MOQ: 500; Component Type: Standard; ComponentLink1Description: Manufacturer Link; ComponentLink2Description: Datasheet; ComponentLink2URL: http://industrial.panasonic.com/www-data/pdf/ABA0000/ABA0000CE22.pdf; Published: 11.12.2009; Publisher: ppavlov
C7 C10 C15 C18 C23 C26 = CC1206K-X5R-10V0-10U0: Chip capacitor, 20p; Manufacturer: AVX; Manufacturer Part Number: AVX1206ZD106KAT2A; Voltage: 10V; Tolerance: 10%; ROSH: Yes; Material: X5R; Package: 7" paper reel; Part number: CC1206K-X5R-10V0-10U0; Suppliers: Avnet; Value: 10u; Stock ID: C083; Supplier: Avnet-Abacus; Pb Free: Yes; Component Type: Standard; ComponentLink1Description: Manufacturer Link; ComponentLink2Description: Datasheet; ComponentLink2URL: http://www.yageo.com/pdf/UPY-GPHC_X5R_6.3V-to-50V_3.pdf; Published: 11.11.2009; Publisher: tkondratyuk
C16 C24 = CC0805K-X7R-16V0-10U0: Chip capacitor, 20p; Manufacturer: KEMET, YAGEO; Voltage: 16V; Tolerance: 10%; ROSH: Yes; Material: X7R; Package: 7" paper reel; Part number: CC0805K-X7R-16V0-10U0; Suppliers: Avnet; Temperature: -55 - +125 C; Value: 10u; Supplier: Avnet-Abacus; Pb Free: Yes; Component Type: Standard; ComponentLink1Description: Manufacturer Link; ComponentLink2Description: Datasheet; ComponentLink2URL: http://www.yageo.com/pdf/UPY-GPHC_X7R_6.3V-to-50V_3.pdf; Published: 11.11.2009; Publisher: tkondratyuk
C110-C119 = CC0805K-X5R-50V0-1N00: as C99 on sheet CV060_IO; Package: 7" paper reel; Part number: CC0805K-X5R-50V0-1N00; Suppliers: Avnet; Temperature: -55 - +125 C; Value: 1n; Supplier: Avnet-Abacus; Pb Free: Yes; Component Type: Standard; ComponentLink1Description: Manufacturer Link; ComponentLink2Description: Datasheet; ComponentLink2URL: http://www.yageo.com/pdf/UPY-GPHC_X5R_6.3V-to-50V_3.pdf; Published: 05.04.2010; Publisher: ppavlov
D1-D4 = LM385BD-2-5: Micropower Voltage Reference Diode; Manufacturer: TI; Pb Free: Yes; Part Number: LM385BD-2-5; Temperature: -40 - +125 C; Manufacturer Part Number: LM385BD-2-5; Component Type: Standard; ComponentLink1Description: Manufacturer Link; Case: SO-8; ComponentLink2Description: Datasheet; Published: 05.01.2010; Publisher: ppavlov
JP1 = 2EDGR-5.08-08P-14: as JP8 on sheet CV060_IO; Part Number: 2EDGR-5.08-08P-14; Temperature: -40 - +105 C; Supplier: Biakom; Component Type: Standard; ComponentLink1Description: Manufacturer Link; Case: PHOENIX_5.08_8PINS; ComponentLink2Description: Datasheet; Published: 17.08.2010; Publisher: ppavlov
JP2 = 2EDGR-5.08-02P-14: as JP11 on sheet CV060_IO; Part Number: 2EDGR-5.08-02P-14; Temperature: -40 - +105 C; Component Type: Standard; ComponentLink1Description: Manufacturer Link; Case: PHOENIX_5.08_2PINS; ComponentLink2Description: Datasheet; Published: 04.01.2010; Publisher: ppavlov
R1 R2 R8 R9 R22 = RC0805F-750R: Chip resistor; Manufacturer: PHILIPS, SAMSUNG; Voltage: 200V; Power: 1/10W; Tolerance: 1%; Pb Free: Yes; Value: 750R; Part Number: RC0805F-750R; Temperature: -55 - +155 C; Supplier: Megasan; Component Type: Standard; ComponentLink1Description: Manufacturer Link; ComponentLink2Description: Datasheet; ComponentLink2URL: http://www.yageo.com/pdf/PYu-RC1206_51_RoHS_L_4.pdf; Published: 11.12.2009; Publisher: ppavlov
R3 R10 R11 R27 R28 = RC0805F-62K0: Chip resistor; Manufacturer: PHILIPS, SAMSUNG; Voltage: 200V; Power: 1/10W; Tolerance: 1%; Pb Free: Yes; Value: 62K; Part Number: RC0805F-62K0; Temperature: -55 - +155 C; Supplier: Megasan; Component Type: Standard; ComponentLink1Description: Manufacturer Link; ComponentLink2Description: Datasheet; ComponentLink2URL: http://www.yageo.com/pdf/PYu-RC1206_51_RoHS_L_4.pdf; Published: 11.12.2009; Publisher: ppavlov
R4 R5 R12 R29 = RC0805F-24K0: Chip resistor; Manufacturer: PHILIPS, SAMSUNG; Voltage: 200V; Power: 1/10W; Tolerance: 1%; Pb Free: Yes; Value: 24K; Part Number: RC0805F-24K0; Temperature: -55 - +155 C; Supplier: Megasan; Component Type: Standard; ComponentLink1Description: Manufacturer Link; ComponentLink2Description: Datasheet; ComponentLink2URL: http://www.yageo.com/pdf/PYu-RC1206_51_RoHS_L_4.pdf; Published: 11.12.2009; Publisher: ppavlov
R6 R7 R13-R17 R30-R34 = RC0805F-1K00: as R83 on sheet CV060_IO; Value: 1k; Part Number: RC0805F-1K00; Temperature: -55 - +155 C; Supplier: Megasan; Component Type: Standard; ComponentLink1Description: Manufacturer Link; ComponentLink2Description: Datasheet; ComponentLink2URL: http://www.yageo.com/pdf/PYu-RC1206_51_RoHS_L_4.pdf; Published: 11.12.2009; Publisher: ppavlov
R20 R21 R23-R26 = RC0805F-51R0: as R106 on sheet CV060_IO; Value: 51R; Part Number: RC0805F-51R0; Temperature: -55 - +155 C; Supplier: Megasan; Component Type: Standard; ComponentLink1Description: Manufacturer Link; ComponentLink2Description: Datasheet; ComponentLink2URL: http://www.yageo.com/pdf/PYu-RC1206_51_RoHS_L_4.pdf; Published: 11.12.2009; Publisher: ppavlov
R131 = RC0805F-000R: Chip resistor; Manufacturer: PHILIPS, SAMSUNG; Voltage: 200V; Power: 1/10W; Tolerance: 1%; Pb Free: Yes; Value: 0R; Part Number: RC0805F-000R; Temperature: -55 - +155 C; Supplier: Megasan; Component Type: Standard; ComponentLink1Description: Manufacturer Link; ComponentLink2Description: Datasheet; ComponentLink2URL: http://www.yageo.com/pdf/PYu-RC1206_51_RoHS_L_4.pdf; Published: 11.12.2009; Publisher: ppavlov
U1 = 1-05-12S: as U11 on sheet CV060_AO; Part Number: 1-05-12S; Temperature: -40 - +85 C; Component Type: Standard; ComponentLink1Description: Manufacturer Link; Case: SIP4; ComponentLink2Description: Datasheet; Published: 07.01.2010; Publisher: ppavlov
U2 = L78L05CD: as U12 on sheet CV060_AO; Part Number: L78L05CD; Temperature: -40 - +150 C; Manufacturer Part Number: L78L05CD; Component Type: Standard; ComponentLink1Description: Manufacturer Link; Case: SO-8; ComponentLink2Description: Datasheet; Published: 07.01.2010; Publisher: ppavlov
U3 U4 U8-U10 = AD8602AR: Dual Precision, Low-Power BiFET Operational Amplifier; Manufacturer: AD; Pb Free: Yes; ID: AD8602AR; Type: IC; Value: AD8602AR; Part Number: AD8602AR; Temperature: -40 - +125 C; Manufacturer Part Number: AD8602AR; Component Type: Standard; ComponentLink1Description: Manufacturer Link; Case: SO-8; ComponentLink2Description: Datasheet; ComponentLink2URL: http://www.analog.com/static/imported-files/Data_Sheets/AD8601_8602_8604.pdf; Published: 05.01.2010; Publisher: ppavlov
U5 = CD74HC4051M: High-Speed CMOS Logic / Analog Multiplexers/Demultiplexers; Manufacturer: TI; Package Information: Latest Revision: Jan-1997; Pb Free: Yes; Published: 06.01.2010; Revision: 17-Jul-2002: Re-released for DXP Platform.; Datasheet: Latest Revision: Jun-1989; Package Reference: SO16; Publisher: ppavlov; Part Number: CD74HC4051M; Temperature: -55 - +125 C; Supplier: EBV; Manufacturer Part Number: CD74HC4051M; Component Type: Standard; ComponentLink1Description: Manufacturer Link; Case: SO-16; ComponentLink2Description: Datasheet; ComponentLink2URL: http://focus.ti.com/docs/prod/folders/print/cd74hct4051.html
U6 = ADS7816P: 12bit ADC; Manufacturer: TI; Pb Free: Yes; Part Number: ADS7816P; Temperature: -40 - +100 C; Manufacturer Part Number: ADS7816P; Component Type: Standard; ComponentLink1Description: Manufacturer Link; Case: DIP-8; ComponentLink2Description: Datasheet; Published: 05.01.2010; Publisher: ppavlov
U7 = TMP441AIDCNT: ± 1 ° C TEMPERATURE SENSOR / with Automatic Beta Compensation; Manufacturer: TI; Pb Free: Yes; Part Number: TMP441AIDCNT; Temperature: – 55 - +127 C; Manufacturer Part Number: TMP441AIDCNT; Component Type: Standard; ComponentLink1Description: Manufacturer Link; Case: SOT23-8; ComponentLink2Description: Datasheet; Published: 17.11.2009; Publisher: ppavlov

## Nets that join several sheets
+3.3VD: CV060_CPU (54 pins), CV060_POWER (8 pins), CV060_IO (8 pins), CV060_AI (U7.3 U7.4 U7.8)
+5VD: CV060_CPU (17 pins), CV060_POWER (9 pins), CV060_IO (10 pins), CV060_AO (C29.1 U11.2), CV060_AI (C2.1 U1.2)
DGND: CV060_CPU (98 pins), CV060_POWER (6 pins), CV060_IO (34 pins), CV060_AO (5 pins), CV060_AI (C2.2 R131.2 U1.1 U7.5)
EARTH: CV060_CPU (10 pins), CV060_POWER (8 pins), CV060_AI (10 pins)
DI_00: CV060_CPU (U24.61), CV060_IO (C99.1 R91.1 U36.4)
DI_01: CV060_CPU (U24.35), CV060_IO (C100.1 R98.1 U39.4)
DI_02: CV060_CPU (U24.29), CV060_IO (C101.1 R107.1 U43.4)
DI_03: CV060_CPU (U24.25), CV060_IO (C102.1 R115.1 U46.4)
DI_04: CV060_CPU (U24.6), CV060_IO (C103.1 R92.1 U37.4)
DI_05: CV060_CPU (U24.5), CV060_IO (C104.1 R99.1 U40.4)
DI_06: CV060_CPU (U24.2), CV060_IO (C105.1 R108.1 U44.4)
DI_07: CV060_CPU (U24.1), CV060_IO (C106.1 R116.1 U47.4)
DO_00: CV060_CPU (U31.21), CV060_IO (R105.1)
DO_01: CV060_CPU (U31.20), CV060_IO (R110.1)
DO_02: CV060_CPU (U31.19), CV060_IO (R117.1)
DO_03: CV060_CPU (U31.18), CV060_IO (R120.1)
DO_04: CV060_CPU (U31.17), CV060_IO (R83.1)
DO_05: CV060_CPU (U31.16), CV060_IO (R86.1)
DO_06: CV060_CPU (U31.15), CV060_IO (R93.1)
DO_07: CV060_CPU (U31.14), CV060_IO (R100.1)
NetC121_1: CV060_CPU (7 pins), CV060_AI (U7.6)
NetC122_1: CV060_CPU (7 pins), CV060_AI (U7.7)
NetR20_2: CV060_CPU (U24.72), CV060_AI (R20.2)
NetR21_2: CV060_CPU (U24.73), CV060_AI (R21.2)
NetR23_2: CV060_CPU (U24.74), CV060_AI (R23.2)
NetR26_2: CV060_CPU (U24.67), CV060_AI (R26.2)
NetR36_1: CV060_CPU (U30.19), CV060_AO (R36.1)
NetR44_1: CV060_CPU (U30.18), CV060_AO (R44.1)
NetR52_1: CV060_CPU (U30.17), CV060_AO (R52.1)
SSICLK: CV060_CPU (JP14.5 U20.2 U24.28), CV060_AI (R24.2)
SSIRX: CV060_CPU (JP14.7 U20.8 U24.30), CV060_AI (R25.2)